# Altium schematic sheet LT1990.SchDoc
size A; SheetNumber: 6; SheetTotal: 13
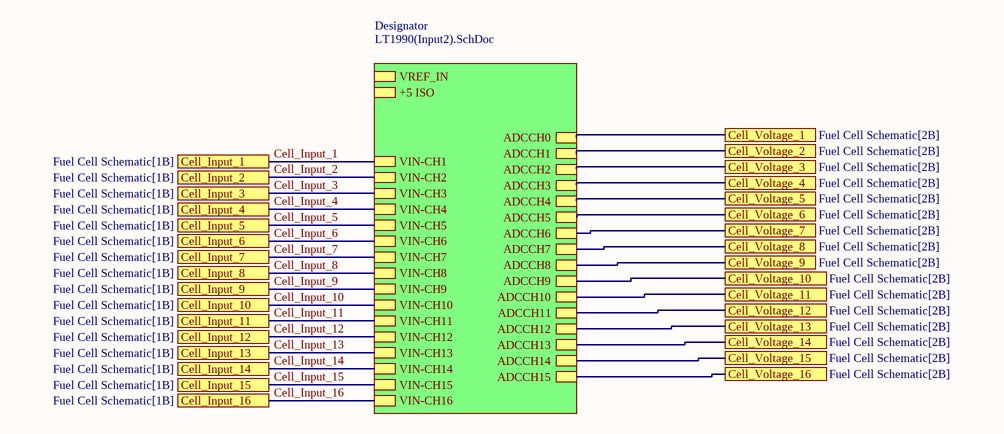
[diagram p0: LT1990.SchDoc]

## Sub-sheets
Designator = LT1990(Input2).SchDoc: ADCCH1, ADCCH2, ADCCH3, ADCCH4, ADCCH5, ADCCH6, ADCCH7, ADCCH8, ADCCH9, ADCCH10, ADCCH11, ADCCH12, ADCCH13, ADCCH14, ADCCH15, ADCCH0, VIN-CH3, VIN-CH4, VIN-CH5, VIN-CH6, VIN-CH8, VIN-CH9, VIN-CH10, VIN-CH11, VIN-CH12, VIN-CH13, VIN-CH14, VIN-CH15, VIN-CH16, VIN-CH2, VIN-CH1, VIN-CH7, VREF_IN, +5 ISO

## Ports
Cell_Input_1 (see Fuel Cell Schematic[1B]), Cell_Input_2 (see Fuel Cell Schematic[1B]), Cell_Input_3 (see Fuel Cell Schematic[1B]), Cell_Input_4 (see Fuel Cell Schematic[1B]), Cell_Input_5 (see Fuel Cell Schematic[1B]), Cell_Input_6 (see Fuel Cell Schematic[1B]), Cell_Input_7 (see Fuel Cell Schematic[1B]), Cell_Input_8 (see Fuel Cell Schematic[1B]), Cell_Input_9 (see Fuel Cell Schematic[1B]), Cell_Input_10 (see Fuel Cell Schematic[1B]), Cell_Input_11 (see Fuel Cell Schematic[1B]), Cell_Input_12 (see Fuel Cell Schematic[1B]), Cell_Input_13 (see Fuel Cell Schematic[1B]), Cell_Input_14 (see Fuel Cell Schematic[1B]), Cell_Input_15 (see Fuel Cell Schematic[1B]), Cell_Input_16 (see Fuel Cell Schematic[1B]), Cell_Voltage_1 (see Fuel Cell Schematic[2B]), Cell_Voltage_2 (see Fuel Cell Schematic[2B]), Cell_Voltage_3 (see Fuel Cell Schematic[2B]), Cell_Voltage_4 (see Fuel Cell Schematic[2B]), Cell_Voltage_5 (see Fuel Cell Schematic[2B]), Cell_Voltage_6 (see Fuel Cell Schematic[2B]), Cell_Voltage_7 (see Fuel Cell Schematic[2B]), Cell_Voltage_8 (see Fuel Cell Schematic[2B]), Cell_Voltage_9 (see Fuel Cell Schematic[2B]), Cell_Voltage_10 (see Fuel Cell Schematic[2B]), Cell_Voltage_11 (see Fuel Cell Schematic[2B]), Cell_Voltage_12 (see Fuel Cell Schematic[2B]), Cell_Voltage_13 (see Fuel Cell Schematic[2B]), Cell_Voltage_14 (see Fuel Cell Schematic[2B]), Cell_Voltage_15 (see Fuel Cell Schematic[2B]), Cell_Voltage_16 (see Fuel Cell Schematic[2B])

## Nets
Cell_Input_1: port Cell_Input_1, sheet Designator/VIN-CH1
Cell_Input_2: port Cell_Input_2, sheet Designator/VIN-CH2
Cell_Input_3: port Cell_Input_3, sheet Designator/VIN-CH3
Cell_Input_4: port Cell_Input_4, sheet Designator/VIN-CH4
Cell_Input_5: port Cell_Input_5, sheet Designator/VIN-CH5
Cell_Input_6: port Cell_Input_6, sheet Designator/VIN-CH6
Cell_Input_7: port Cell_Input_7, sheet Designator/VIN-CH7
Cell_Input_8: port Cell_Input_8, sheet Designator/VIN-CH8
Cell_Input_9: port Cell_Input_9, sheet Designator/VIN-CH9
Cell_Input_10: port Cell_Input_10, sheet Designator/VIN-CH10
Cell_Input_11: port Cell_Input_11, sheet Designator/VIN-CH11
Cell_Input_12: port Cell_Input_12, sheet Designator/VIN-CH12
Cell_Input_13: port Cell_Input_13, sheet Designator/VIN-CH13
Cell_Input_14: port Cell_Input_14, sheet Designator/VIN-CH14
Cell_Input_15: port Cell_Input_15, sheet Designator/VIN-CH15
Cell_Input_16: port Cell_Input_16, sheet Designator/VIN-CH16
Cell_Voltage_1: port Cell_Voltage_1, sheet Designator/ADCCH0
Cell_Voltage_2: port Cell_Voltage_2, sheet Designator/ADCCH1
Cell_Voltage_3: port Cell_Voltage_3, sheet Designator/ADCCH2
Cell_Voltage_4: port Cell_Voltage_4, sheet Designator/ADCCH3
Cell_Voltage_5: port Cell_Voltage_5, sheet Designator/ADCCH4
Cell_Voltage_6: port Cell_Voltage_6, sheet Designator/ADCCH5
Cell_Voltage_7: port Cell_Voltage_7, sheet Designator/ADCCH6
Cell_Voltage_8: port Cell_Voltage_8, sheet Designator/ADCCH7
Cell_Voltage_9: port Cell_Voltage_9, sheet Designator/ADCCH8
Cell_Voltage_10: port Cell_Voltage_10, sheet Designator/ADCCH9
Cell_Voltage_11: port Cell_Voltage_11, sheet Designator/ADCCH10
Cell_Voltage_12: port Cell_Voltage_12, sheet Designator/ADCCH11
Cell_Voltage_13: port Cell_Voltage_13, sheet Designator/ADCCH12
Cell_Voltage_14: port Cell_Voltage_14, sheet Designator/ADCCH13
Cell_Voltage_15: port Cell_Voltage_15, sheet Designator/ADCCH14
Cell_Voltage_16: port Cell_Voltage_16, sheet Designator/ADCCH15